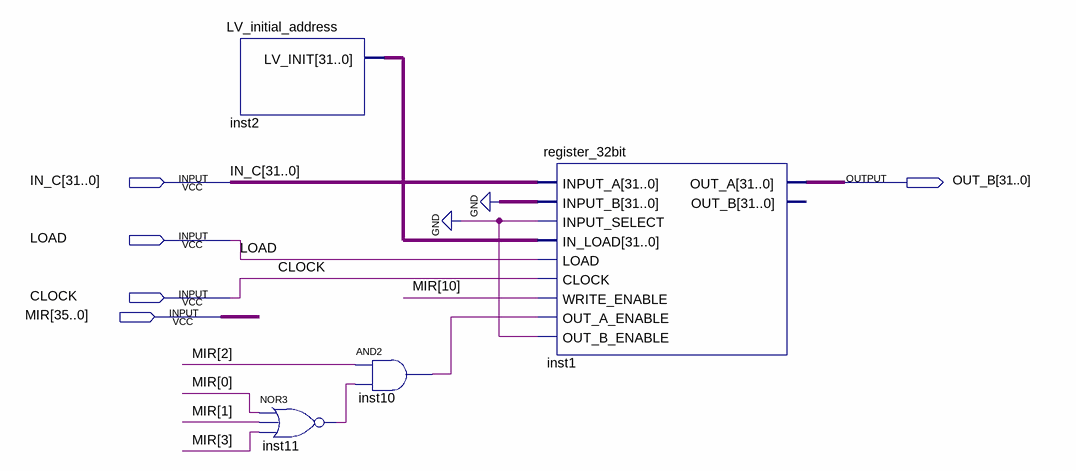
[diagram p0: schematic sheet]
// Quartus schematic SP.bdf as structural Verilog: 4 symbols, 5 pins
module SP (
  input  [31:0] IN_C,
  input  LOAD,
  input  CLOCK,
  input  [35:0] MIR,
  output [31:0] OUT_B
);

  wire inst10_out, inst11_out;
  wire [31:0] inst2_lv_init;

  LV_initial_address inst2 (.LV_INIT(inst2_lv_init));
  nor inst11 (inst11_out, MIR[0], MIR[1], MIR[3]);
  and inst10 (inst10_out, MIR[2], inst11_out);
  register_32bit inst1 (
    .INPUT_A(IN_C), .INPUT_B({32{1'b0}}), .INPUT_SELECT(1'b0), .IN_LOAD(inst2_lv_init), .LOAD(LOAD),
    .CLOCK(CLOCK), .WRITE_ENABLE(MIR[10]), .OUT_A_ENABLE(inst10_out), .OUT_B_ENABLE(1'b0), .OUT_A(OUT_B));  // open: OUT_B
endmodule
